# EAGLE schematic Mainboard - Prototype 1 (EAGLE 7.6.0)
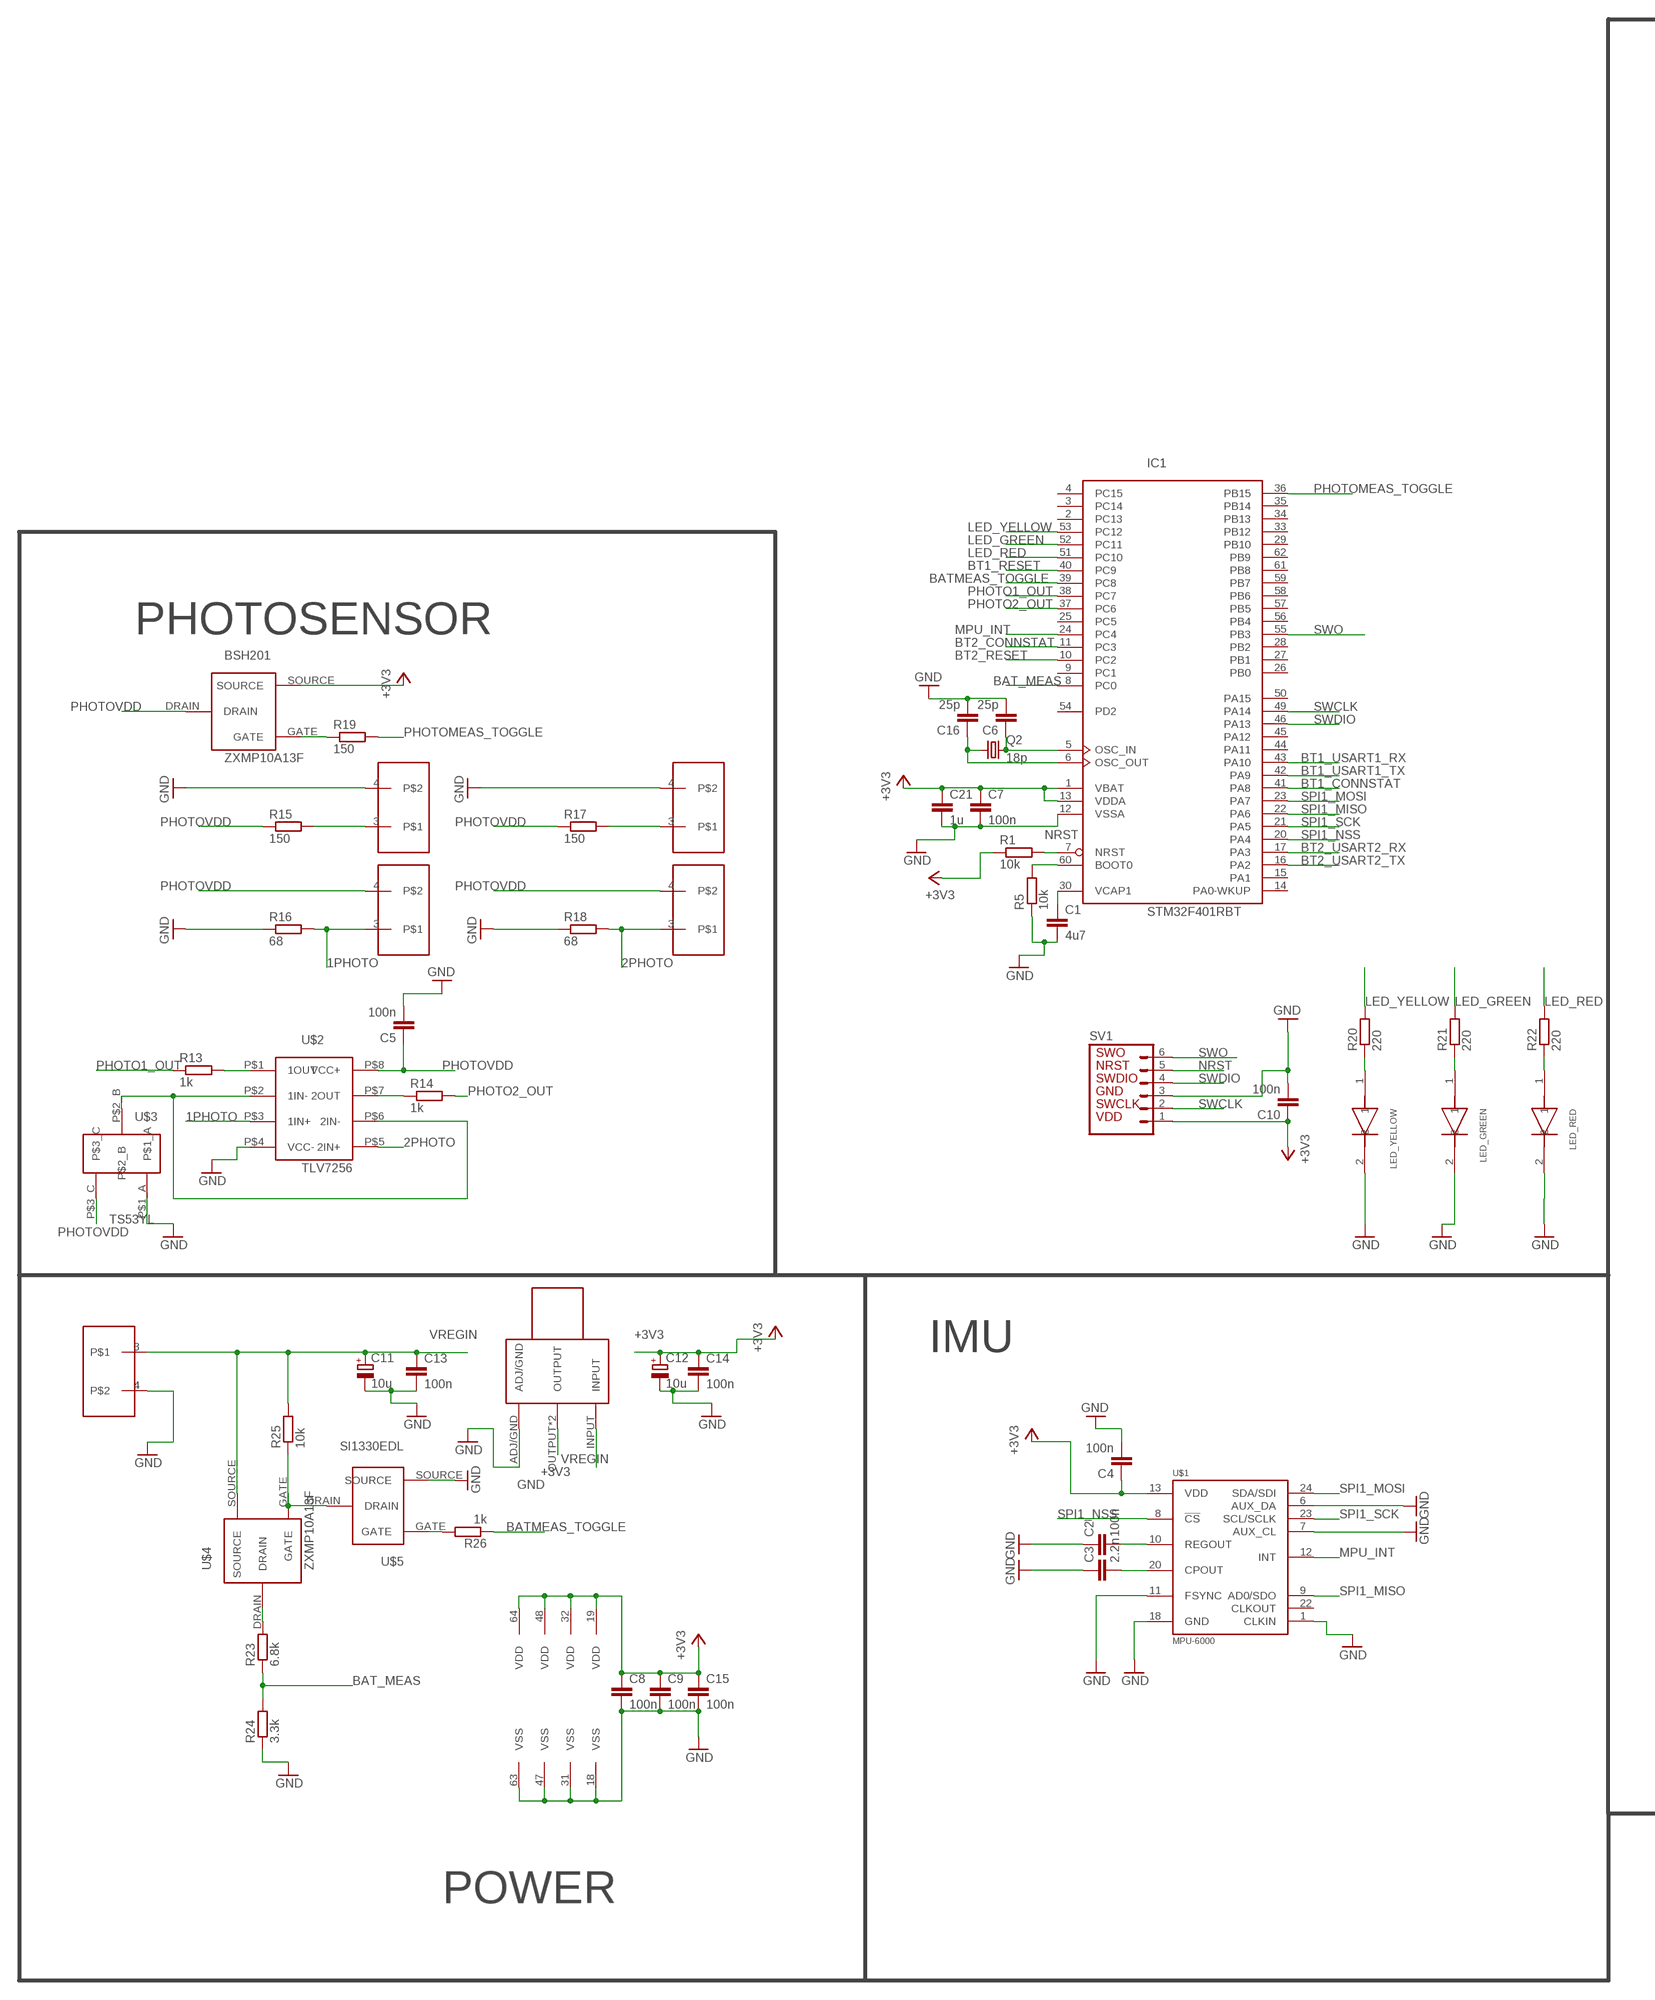
[diagram p0: schematic, sheet 1, part 1 of 2]
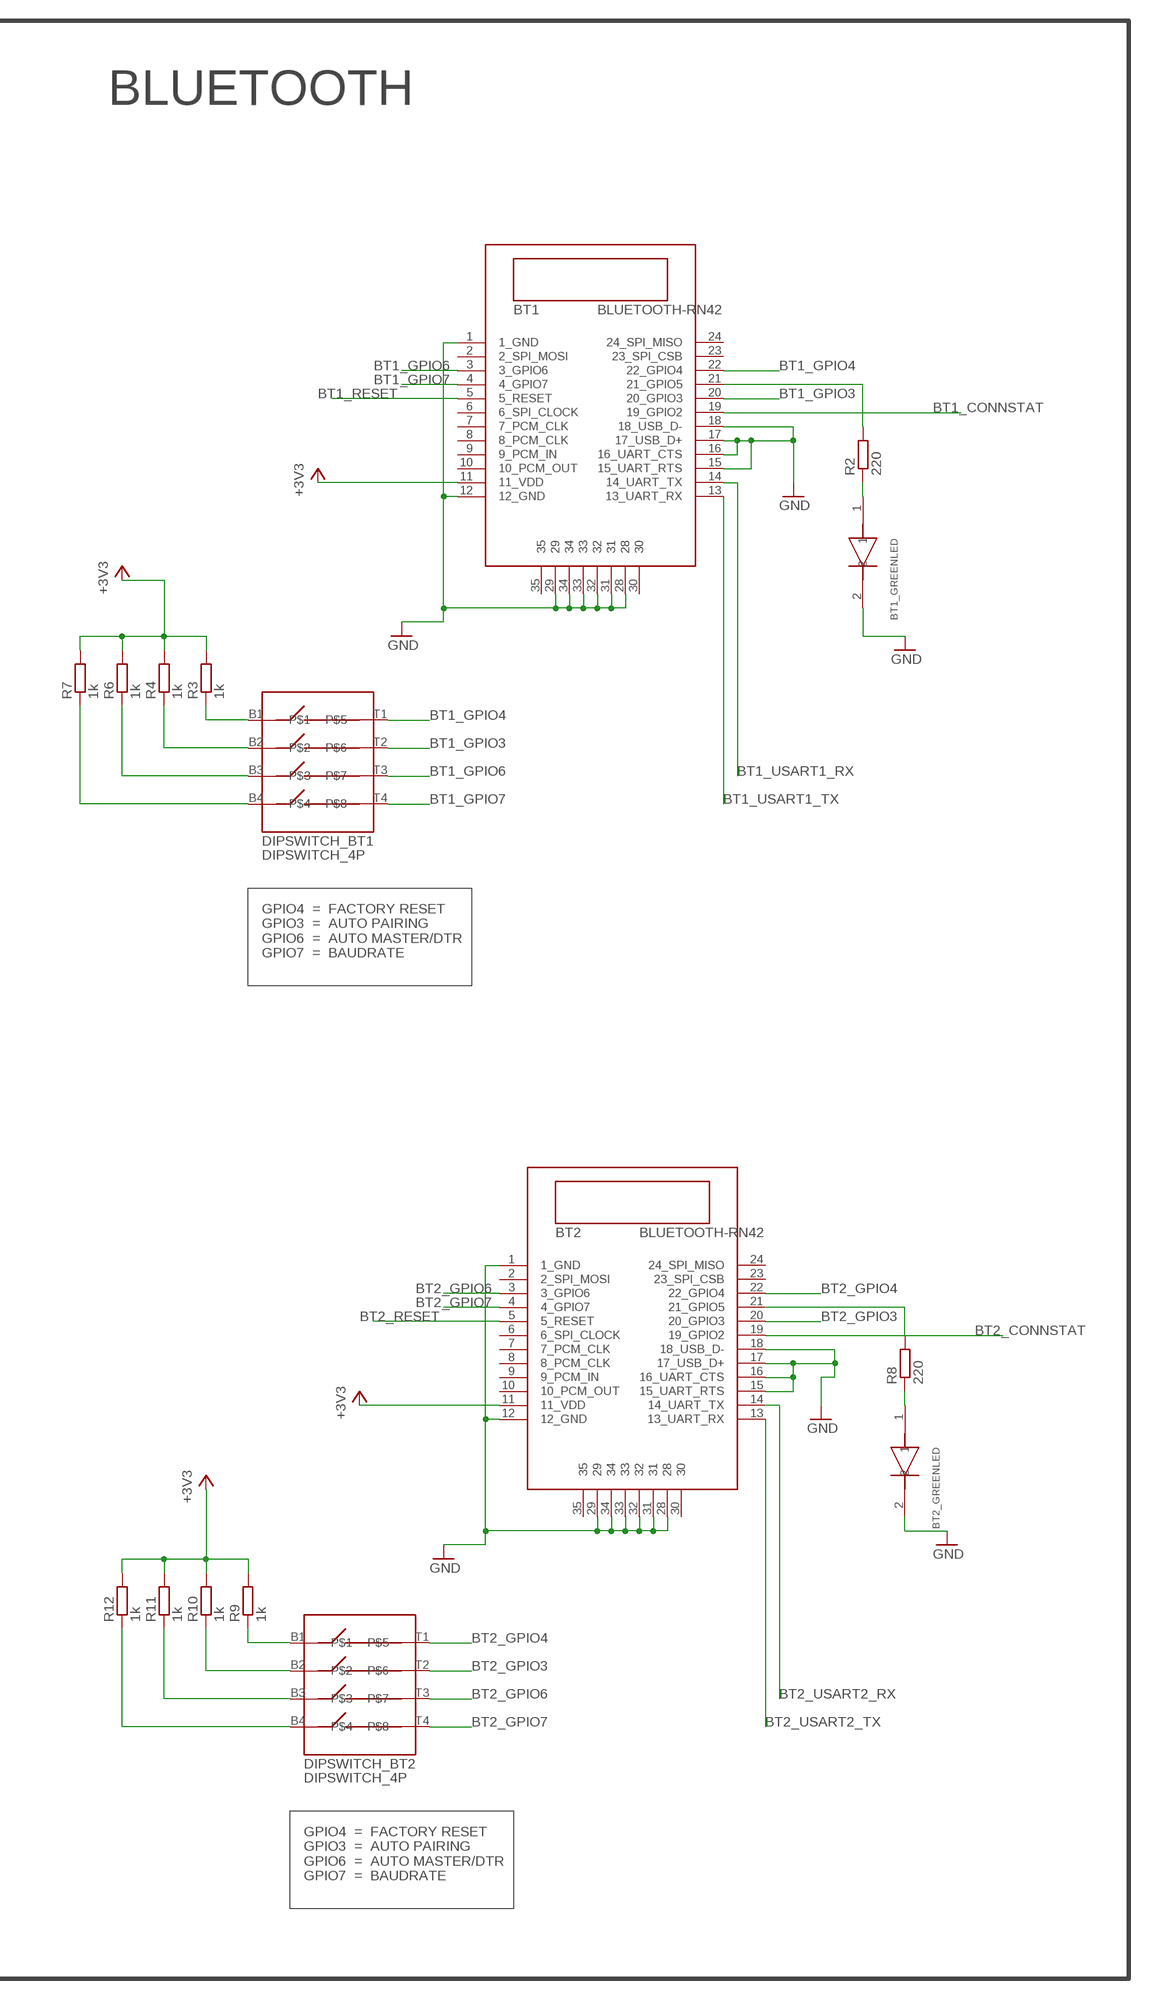
[diagram p1: schematic, sheet 1, part 2 of 2]

## Parts
BSH201  ZXMP10A13F  [P-CHANNEL]
BT1  BLUETOOTH-RN42  [RN42]
BT1_GREENLED  SMD_LED  [SMD_LED_CUSTOM]
BT2  BLUETOOTH-RN42  [RN42]
BT2_GREENLED  SMD_LED  [SMD_LED_CUSTOM]
C1  4u7  C-EUC0805  [C0805]
C2  100n  C-EUC0805  [C0805]
C3  2.2n  C-EUC0805  [C0805]
C4  100n  C-EUC0805  [C0805]
C5  100n  C-EUC0805  [C0805]
C6  25p  C-EUC0805  [C0805]
C7  100n  C-EUC0805  [C0805]
C8  100n  C-EUC0805  [C0805]
C9  100n  C-EUC0805  [C0805]
C10  100n  C-EUC0805  [C0805]
C11  10u  CPOL-EU153CLV-0505  [153CLV-0505]
C12  10u  CPOL-EU153CLV-0505  [153CLV-0505]
C13  100n  C-EUC0805  [C0805]
C14  100n  C-EUC0805  [C0805]
C15  100n  C-EUC0805  [C0805]
C16  25p  C-EUC0805  [C0805]
C21  1u  C-EUC0805  [C0805]
DIPSWITCH_BT1  DIPSWITCH_4P  [DIPSWITCH4P]
DIPSWITCH_BT2  DIPSWITCH_4P  [DIPSWITCH4P]
IC1  STM32F401RBT  [LQFP64]
LED_GREEN  SMD_LED  [SMD_LED_CUSTOM]
LED_RED  SMD_LED  [SMD_LED_CUSTOM]
LED_YELLOW  SMD_LED  [SMD_LED_CUSTOM]
LM1117-1  LM1117  [LM1117]
Q2  18p  CRYSTALHC49UP  [HC49UP]
R1  10k  R-EU_R0805  [R0805]
R2  220  R-EU_R0805  [R0805]
R3  1k  R-EU_R0805  [R0805]
R4  1k  R-EU_R0805  [R0805]
R5  10k  R-EU_R0805  [R0805]
R6  1k  R-EU_R0805  [R0805]
R7  1k  R-EU_R0805  [R0805]
R8  220  R-EU_R0805  [R0805]
R9  1k  R-EU_R0805  [R0805]
R10  1k  R-EU_R0805  [R0805]
R11  1k  R-EU_R0805  [R0805]
R12  1k  R-EU_R0805  [R0805]
R13  1k  R-EU_R0805  [R0805]
R14  1k  R-EU_R0805  [R0805]
R15  150  R-EU_R0805  [R0805]
R16  68  R-EU_R0805  [R0805]
R17  150  R-EU_R0805  [R0805]
R18  68  R-EU_R0805  [R0805]
R19  150  R-EU_R0805  [R0805]
R20  220  R-EU_R0805  [R0805]
R21  220  R-EU_R0805  [R0805]
R22  220  R-EU_R0805  [R0805]
R23  6.8k  R-EU_R0805  [R0805]
R24  3.3k  R-EU_R0805  [R0805]
R25  10k  R-EU_R0805  [R0805]
R26  1k  R-EU_R0805  [R0805]
SKRUVPLINT_2P1  SKRUVPLINT_2P  [SKRUVPLINT_2P]
SKRUVPLINT_2P2  SKRUVPLINT_2P  [SKRUVPLINT_2P]
SKRUVPLINT_2P3  SKRUVPLINT_2P  [SKRUVPLINT_2P]
SKRUVPLINT_2P4  SKRUVPLINT_2P  [SKRUVPLINT_2P]
SKRUVPLINT_2P5  SKRUVPLINT_2P  [SKRUVPLINT_2P]
SV1  MA06-1  [MA06-1]
U$1  MPU-6000  [QFN-24]
U$2  TLV7256  [VSSOP]
U$3  TS53YL  [POT]
U$4  ZXMP10A13F  [P-CHANNEL]
U$5  SI1330EDL  [SOT-323]

## Nets
1PHOTO: R16.2 SKRUVPLINT_2P2.3 U$2.P$3(1IN+)
2PHOTO: R18.2 SKRUVPLINT_2P4.3 U$2.P$5(2IN+)
+3V3: BSH201.SOURCE BT1.11(11_VDD) BT2.11(11_VDD) C4.1 C7.1 C8.1 C9.1 C10.1 C12.+ C14.1 C15.1 C21.1 IC1.1(VBAT) IC1.13(VDDA) IC1.19(VDD) IC1.32(VDD) IC1.48(VDD) IC1.64(VDD) LM1117-1.OUTPUT LM1117-1.OUTPUT2(OUTPUT) R1.1 R3.2 R4.2 R6.2 R7.2 R9.2 R10.2 R11.2 R12.2 SV1.1 U$1.13(VDD)
BAT_MEAS: IC1.8(PC0) R23.1 R24.2
BATMEAS_TOGGLE: IC1.39(PC8) R26.1
BT1_CONNSTAT: BT1.19(19_GPIO2) IC1.41(PA8)
BT1_GPIO3: BT1.20(20_GPIO3) DIPSWITCH_BT1.T2
BT1_GPIO4: BT1.22(22_GPIO4) DIPSWITCH_BT1.T1
BT1_GPIO6: BT1.3(3_GPIO6) DIPSWITCH_BT1.T3
BT1_GPIO7: BT1.4(4_GPIO7) DIPSWITCH_BT1.T4
BT1_RESET: BT1.5(5_RESET) IC1.40(PC9)
BT1_USART1_RX: BT1.14(14_UART_TX) IC1.43(PA10)
BT1_USART1_TX: BT1.13(13_UART_RX) IC1.42(PA9)
BT2_CONNSTAT: BT2.19(19_GPIO2) IC1.11(PC3)
BT2_GPIO3: BT2.20(20_GPIO3) DIPSWITCH_BT2.T2
BT2_GPIO4: BT2.22(22_GPIO4) DIPSWITCH_BT2.T1
BT2_GPIO5: BT2.21(21_GPIO5) R8.2
BT2_GPIO6: BT2.3(3_GPIO6) DIPSWITCH_BT2.T3
BT2_GPIO7: BT2.4(4_GPIO7) DIPSWITCH_BT2.T4
BT2_RESET: BT2.5(5_RESET) IC1.10(PC2)
BT2_USART2_RX: BT2.14(14_UART_TX) IC1.17(PA3)
BT2_USART2_TX: BT2.13(13_UART_RX) IC1.16(PA2)
GND: BT1.1(1_GND) BT1.12(12_GND) BT1.15(15_UART_RTS) BT1.16(16_UART_CTS) BT1.17(17_USB_D+) BT1.18(18_USB_D-) BT1.28 BT1.29 BT1.31 BT1.32 BT1.33 BT1.34 BT1_GREENLED.2 BT2.1(1_GND) BT2.12(12_GND) BT2.15(15_UART_RTS) BT2.16(16_UART_CTS) BT2.17(17_USB_D+) BT2.18(18_USB_D-) BT2.28 BT2.29 BT2.31 BT2.32 BT2.33 BT2.34 BT2_GREENLED.2 C1.2 C2.1 C3.1 C4.2 C5.2 C6.2 C7.2 C8.2 C9.2 C10.2 C11.- C12.- C13.2 C14.2 C15.2 C16.2 C21.2 IC1.12(VSSA) IC1.18(VSS) IC1.31(VSS) IC1.47(VSS) IC1.63(VSS) LED_GREEN.2 LED_RED.2 LED_YELLOW.2 LM1117-1.ADJ/GND R5.1 R16.1 R18.1 R24.1 SKRUVPLINT_2P1.4 SKRUVPLINT_2P3.4 SKRUVPLINT_2P5.4 SV1.3 U$1.1(CLKIN) U$1.6(AUX_DA) U$1.7(AUX_CL) U$1.11(FSYNC) U$1.18(GND) U$2.P$4(VCC-) U$3.P$1_A U$5.SOURCE
LED_GREEN: IC1.52(PC11) R21.2
LED_RED: IC1.51(PC10) R22.2
LED_YELLOW: IC1.53(PC12) R20.2
MPU_INT: IC1.24(PC4) U$1.12(INT)
N$1: C1.1 IC1.30(VCAP1)
N$2: IC1.60(BOOT0) R5.2
N$3: R13.2 U$2.P$1(1OUT)
N$4: BT1.21(21_GPIO5) R2.2
N$5: DIPSWITCH_BT1.B1 R3.1
N$6: DIPSWITCH_BT1.B2 R4.1
N$7: DIPSWITCH_BT1.B3 R6.1
N$8: C6.1 IC1.5(OSC_IN) Q2.2
N$9: C16.1 IC1.6(OSC_OUT) Q2.1
N$10: DIPSWITCH_BT1.B4 R7.1
N$11: BT1_GREENLED.1 R2.1
N$12: DIPSWITCH_BT2.B1 R9.1
N$13: DIPSWITCH_BT2.B2 R10.1
N$14: DIPSWITCH_BT2.B3 R11.1
N$15: DIPSWITCH_BT2.B4 R12.1
N$16: BT2_GREENLED.1 R8.1
N$17: C2.2 U$1.10(REGOUT)
N$18: C3.2 U$1.20(CPOUT)
N$19: U$2.P$2(1IN-) U$2.P$6(2IN-) U$3.P$2_B
N$20: R14.1 U$2.P$7(2OUT)
N$21: R15.2 SKRUVPLINT_2P1.3
N$22: R17.2 SKRUVPLINT_2P3.3
N$23: BSH201.GATE R19.1
N$25: R23.2 U$4.DRAIN
N$26: R25.1 U$4.GATE U$5.DRAIN
N$27: R26.2 U$5.GATE
N$28: LED_YELLOW.1 R20.1
N$31: LED_GREEN.1 R21.1
N$33: LED_RED.1 R22.1
NRST: IC1.7(NRST) R1.2 SV1.5
PHOTO1_OUT: IC1.38(PC7) R13.1
PHOTO2_OUT: IC1.37(PC6) R14.2
PHOTOMEAS_TOGGLE: IC1.36(PB15) R19.2
PHOTOVDD: BSH201.DRAIN C5.1 R15.1 R17.1 SKRUVPLINT_2P2.4 SKRUVPLINT_2P4.4 U$2.P$8(VCC+) U$3.P$3_C
SPI1_MISO: IC1.22(PA6) U$1.9(AD0/SDO)
SPI1_MOSI: IC1.23(PA7) U$1.24(SDA/SDI)
SPI1_NSS: IC1.20(PA4) U$1.8(!CS)
SPI1_SCK: IC1.21(PA5) U$1.23(SCL/SCLK)
SWCLK: IC1.49(PA14) SV1.2
SWDIO: IC1.46(PA13) SV1.4
SWO: IC1.55(PB3) SV1.6
VREGIN: C11.+ C13.1 LM1117-1.INPUT R25.2 SKRUVPLINT_2P5.3 U$4.SOURCE
Unconnected: BT1.2(2_SPI_MOSI) BT1.6(6_SPI_CLOCK) BT1.7(7_PCM_CLK) BT1.8(8_PCM_CLK) BT1.9(9_PCM_IN) BT1.10(10_PCM_OUT) BT1.23(23_SPI_CSB) BT1.24(24_SPI_MISO) BT1.30 BT1.35 BT2.2(2_SPI_MOSI) BT2.6(6_SPI_CLOCK) BT2.7(7_PCM_CLK) BT2.8(8_PCM_CLK) BT2.9(9_PCM_IN) BT2.10(10_PCM_OUT) BT2.23(23_SPI_CSB) BT2.24(24_SPI_MISO) BT2.30 BT2.35 IC1.2(PC13) IC1.3(PC14) IC1.4(PC15) IC1.9(PC1) IC1.14(PA0-WKUP) IC1.15(PA1) IC1.25(PC5) IC1.26(PB0) IC1.27(PB1) IC1.28(PB2) IC1.29(PB10) IC1.33(PB12) IC1.34(PB13) IC1.35(PB14) IC1.44(PA11) IC1.45(PA12) IC1.50(PA15) IC1.54(PD2) IC1.56(PB4) IC1.57(PB5) IC1.58(PB6) IC1.59(PB7) IC1.61(PB8) IC1.62(PB9) U$1.22(CLKOUT)

## Notes on the sheet
- BLUETOOTH
- PHOTOSENSOR
- GPIO4  =  FACTORY RESET
  GPIO3  =  AUTO PAIRING
  GPIO6  =  AUTO MASTER/DTR
  GPIO7  =  BAUDRATE
- IMU
- GPIO4  =  FACTORY RESET
  GPIO3  =  AUTO PAIRING
  GPIO6  =  AUTO MASTER/DTR
  GPIO7  =  BAUDRATE
- POWER

## Library data of the parts
BSH201 U$4 = ZXMP10A13F:ZXMP10A13F
BT1 BT2 = RN42:BLUETOOTH-RN42
BT1_GREENLED BT2_GREENLED LED_GREEN LED_RED LED_YELLOW = greenled_smd:SMD_LED
C1-C10 C13-C16 C21 = rcl:C-EU: CAPACITOR, European symbol
C11 C12 = rcl:CPOL-EU: POLARIZED CAPACITOR, European symbol
DIPSWITCH_BT1 DIPSWITCH_BT2 = dipswitch4p:DIPSWITCH_4P
IC1 = E7020E:STM32F401R*T: ARM 32-bit Cortex™-M3 CPU 84 MHz maximum frequency 128 to 256 Kbytes of Flash memory 64 kbytes of SRAM 50 GPIOs 1.7 to 3.6 V application supply
LM1117-1 = LM1117-3v3_vreg:LM1117
Q2 = crystal:CRYSTAL: CRYSTAL; OC_FARNELL: unknown; OC_NEWARK: unknown
R1 R5 R13-R19 R23-R26 = rcl:R-EU_: RESISTOR, European symbol
R2-R4 R6-R12 R20-R22 = resistor:R-EU_: RESISTOR, European symbol
SKRUVPLINT_2P1-SKRUVPLINT_2P5 = skruvplint2p_CTB0700:SKRUVPLINT_2P
SV1 = E7020E:MA06-1: PIN HEADER; OC_FARNELL: unknown; OC_NEWARK: unknown
U$1 = MPU-6000:MPU-6000: ITG-3200 3-axis gyro, digital output, qfn24 package; AVAILABILITY: Good; DESCRIPTION: 3-axis gyroscope, 3-axis accelerometer in a 4x4x0.9 housing; MF: InvenSense; MP: MPU-6000; PACKAGE: QFN-24 InvenSense; PRICE: 7.23 USD
U$2 = TLV7256:TLV7256
U$3 = TS53YL:TS53YL
U$5 = SI1330EDL:SI1330EDL